# EAGLE schematic Joystick Module A (EAGLE 9.0.0)
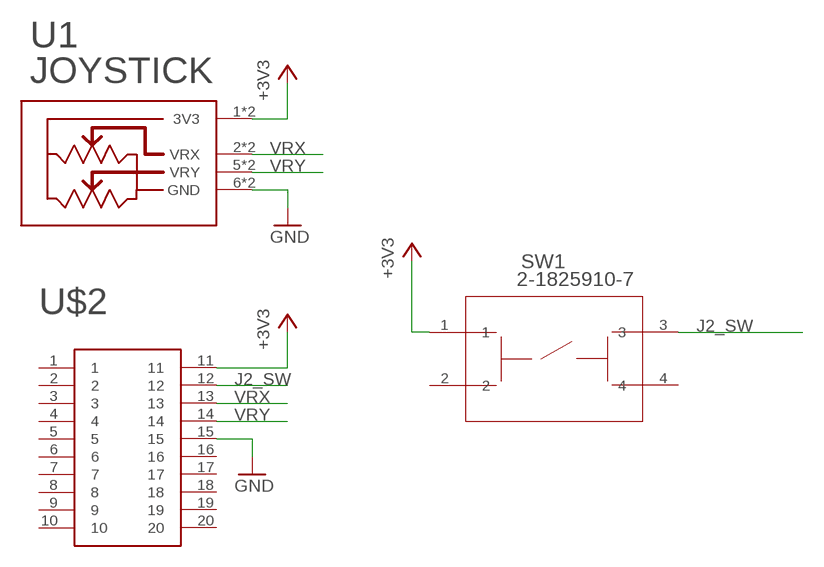
[diagram p0: schematic, sheet 1]

## Parts
SW1  2-1825910-7  [SW4_1825910-G]
U1  27800-JOYSTICK  [27800-JOYSTICK]
U$2  EDGE_CONNECTOR_20POS_CONTACTS  [EDGE_CONNECTOR_20POS_CONTACTS]

## Nets
+3V3: SW1.1 U1.1(3V3) U1.3(3V3) U$2.11
GND: U1.6(GND) U1.8(GND) U$2.15
J2_SW: SW1.3 U$2.12
VRX: U1.2(VRX) U1.4(VRX) U$2.13
VRY: U1.5(VRY) U1.7(VRY) U$2.14
Unconnected: SW1.2 SW1.4 U$2.1 U$2.2 U$2.3 U$2.4 U$2.5 U$2.6 U$2.7 U$2.8 U$2.9 U$2.10 U$2.16 U$2.17 U$2.18 U$2.19 U$2.20

## Library data of the parts
SW1 = spst-tactile-switch:2-1825910-7; MANUFACTURER_PART_NUMBER: 218259107; VENDOR: TE Connectivity
U1 = thanics_robotics:27800-JOYSTICK
U$2 = thanics_robotics:EDGE_CONNECTOR_20POS_CONTACTS